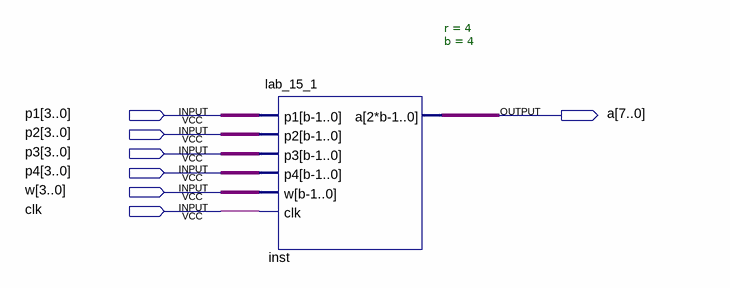
[diagram p0: schematic sheet]
// Quartus schematic lab15_1.bdf as structural Verilog: 1 symbols, 7 pins
module lab15_1 (
  input  [3:0] p1,
  input  [3:0] p2,
  input  [3:0] p3,
  input  [3:0] p4,
  input  [3:0] w,
  input  clk,
  output [7:0] a
);

  lab_15_1 #(.r(4), .b(4)) inst (.p1(p1), .p2(p2), .p3(p3), .p4(p4), .w(w), .clk(clk), .a(a));
endmodule
